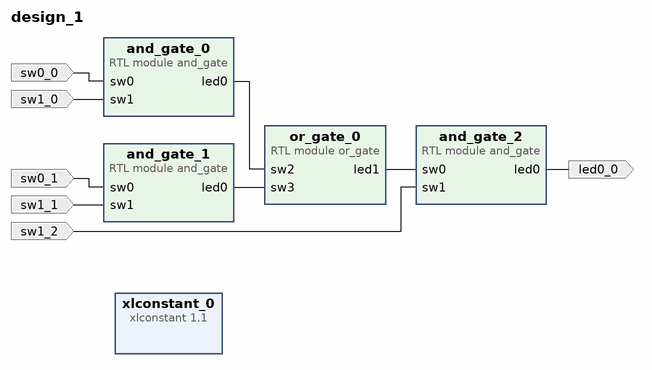
[diagram p0: block diagram of the top level]
# Vivado block design design_1, xc7z020clg400-1, Vivado 2023.1
create_bd_design design_1

create_bd_port -dir O led0_0
create_bd_port -dir I sw0_0
create_bd_port -dir I sw1_0
create_bd_port -dir I sw0_1
create_bd_port -dir I sw1_1
create_bd_port -dir I sw1_2

create_bd_cell -type module -reference and_gate and_gate_0
create_bd_cell -type module -reference or_gate or_gate_0
create_bd_cell -type module -reference and_gate and_gate_1
create_bd_cell -type module -reference and_gate and_gate_2
create_bd_cell -type ip -vlnv xilinx.com:ip:xlconstant:1.1 xlconstant_0

# ---- connections ----

connect_bd_net [get_bd_pins and_gate_0/led0] [get_bd_pins or_gate_0/sw2]
connect_bd_net [get_bd_pins and_gate_1/led0] [get_bd_pins or_gate_0/sw3]
connect_bd_net [get_bd_pins and_gate_2/led0] [get_bd_ports led0_0]
connect_bd_net [get_bd_pins or_gate_0/led1] [get_bd_pins and_gate_2/sw0]
connect_bd_net -net sw0_0_1 [get_bd_ports sw0_0] [get_bd_pins and_gate_0/sw0]
connect_bd_net -net sw0_1_1 [get_bd_ports sw0_1] [get_bd_pins and_gate_1/sw0]
connect_bd_net -net sw1_0_1 [get_bd_ports sw1_0] [get_bd_pins and_gate_0/sw1]
connect_bd_net -net sw1_1_1 [get_bd_ports sw1_1] [get_bd_pins and_gate_1/sw1]
connect_bd_net -net sw1_2_1 [get_bd_ports sw1_2] [get_bd_pins and_gate_2/sw1]

validate_bd_design
save_bd_design
